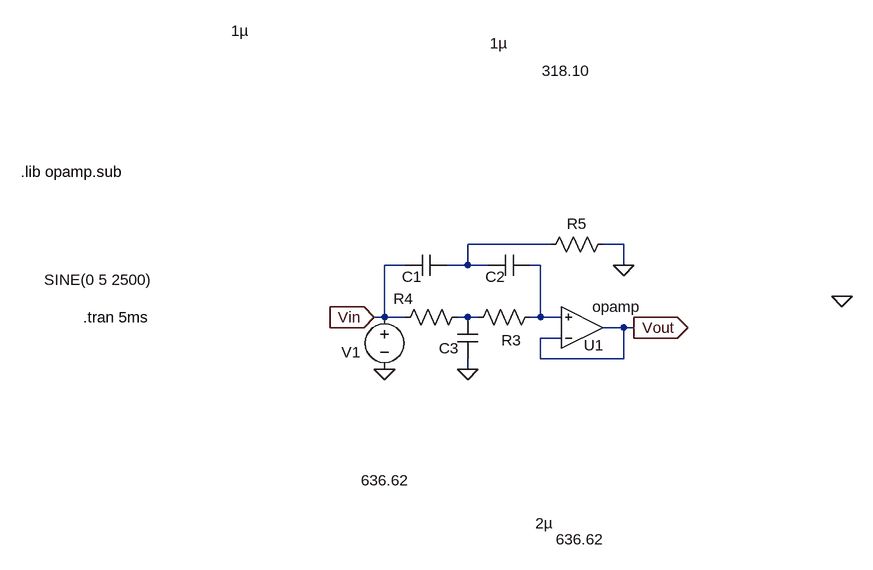
[diagram p0: schematic RB2order.asc]
RB2order.asc, the LTspice schematic file:
Version 4
SHEET 1 1860 1076
WIRE 1392 608 1264 608
WIRE 1504 608 1472 608
WIRE 1168 640 1136 640
WIRE 1264 640 1264 608
WIRE 1264 640 1232 640
WIRE 1296 640 1264 640
WIRE 1376 640 1360 640
WIRE 1504 640 1504 608
WIRE 1136 720 1136 640
WIRE 1136 720 1120 720
WIRE 1168 720 1136 720
WIRE 1264 720 1248 720
WIRE 1280 720 1264 720
WIRE 1376 720 1376 640
WIRE 1376 720 1360 720
WIRE 1408 720 1376 720
WIRE 1504 736 1472 736
WIRE 1520 736 1504 736
WIRE 1408 752 1376 752
WIRE 1376 784 1376 752
WIRE 1504 784 1504 736
WIRE 1504 784 1376 784
WIRE 1264 800 1264 784
FLAG 1136 800 0
FLAG 1520 736 Vout
IOPIN 1520 736 Out
FLAG 1120 720 Vin
IOPIN 1120 720 In
FLAG 1840 688 0
FLAG 1264 800 0
FLAG 1504 640 0
SYMBOL OpAmps\\opamp 1440 800 M180
WINDOW 0 3 37 Left 2
SYMATTR InstName U1
SYMBOL voltage 1136 704 R0
WINDOW 3 -524 -42 Left 2
WINDOW 123 -82 95 Left 2
WINDOW 39 0 0 Left 0
WINDOW 0 -66 70 Left 2
SYMATTR Value SINE(0 5 2500)
SYMATTR InstName V1
SYMBOL cap 1232 624 R90
WINDOW 0 49 54 VBottom 2
WINDOW 3 -360 319 VTop 2
SYMATTR InstName C1
SYMATTR Value 1µ
SYMBOL cap 1360 624 R90
WINDOW 0 49 53 VBottom 2
WINDOW 3 -310 48 VBottom 2
SYMATTR InstName C2
SYMATTR Value 1µ
SYMBOL res 1376 704 R90
WINDOW 0 67 45 VBottom 2
WINDOW 3 342 -61 VTop 2
SYMATTR InstName R3
SYMATTR Value 636.62
SYMBOL res 1264 704 R90
WINDOW 0 3 99 VBottom 2
WINDOW 3 251 127 VTop 2
SYMATTR InstName R4
SYMATTR Value 636.62
SYMBOL cap 1248 720 R0
WINDOW 0 -28 48 Left 2
WINDOW 3 120 317 Left 2
SYMATTR InstName C3
SYMATTR Value 2µ
SYMBOL res 1488 592 R90
WINDOW 0 0 56 VBottom 2
WINDOW 3 -267 73 VTop 2
SYMATTR InstName R5
SYMATTR Value 318.10
TEXT 576 496 Left 2 !.lib opamp.sub
TEXT 672 720 Left 2 !.tran 5ms

The netlist it stands for:
* RB2order.asc
XU1 Vout N002 Vout opamp Aol=100K GBW=10Meg  ; pins invin noninvin out
V1 Vin 0 SINE(0 5 2500)
C1 N001 Vin 1µ
C2 N002 N001 1µ
R3 N002 N003 636.62
R4 N003 Vin 636.62
C3 N003 0 2µ
R5 0 N001 318.10
.lib opamp.sub
.tran 5ms
.backanno
.end